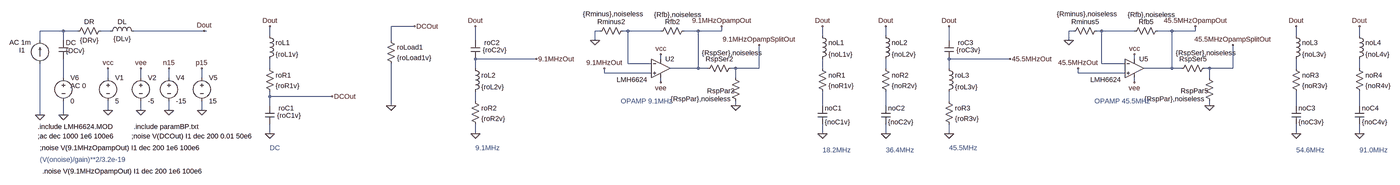
[diagram p0: schematic LT3S4N_9_1MHz.asc, whole sheet]
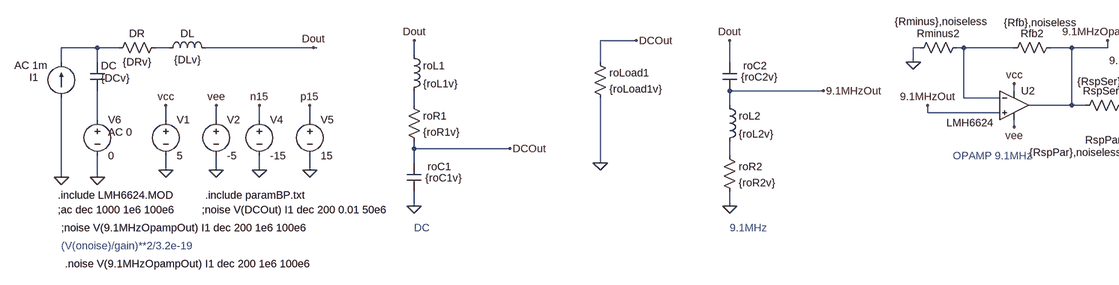
[diagram p1: schematic LT3S4N_9_1MHz.asc, part, row 1 of 1, column 1 of 2]
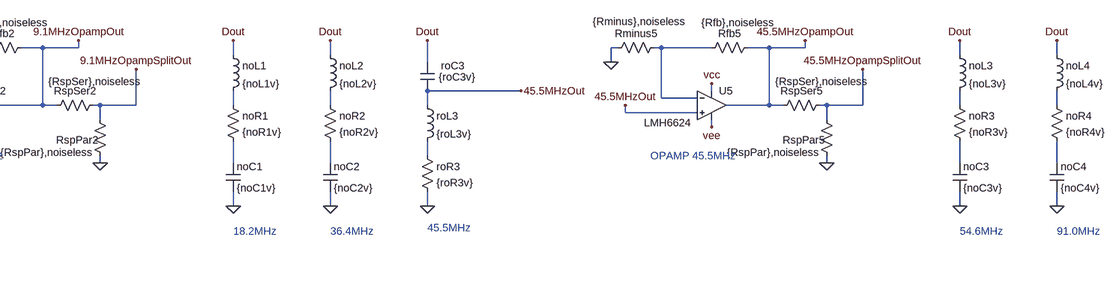
[diagram p2: schematic LT3S4N_9_1MHz.asc, part, row 1 of 1, column 2 of 2]
LT3S4N_9_1MHz.asc, the LTspice schematic file:
Version 4
SHEET 1 3420 1192
WIRE -7720 -3552 -7800 -3552
WIRE -7672 -3552 -7720 -3552
WIRE -7560 -3552 -7592 -3552
WIRE -7240 -3552 -7480 -3552
WIRE -7232 -3552 -7240 -3552
WIRE -7800 -3520 -7800 -3552
WIRE -7720 -3520 -7720 -3552
WIRE -7720 -3392 -7720 -3456
WIRE -7568 -3392 -7568 -3424
WIRE -7456 -3392 -7456 -3424
WIRE -7360 -3392 -7360 -3424
WIRE -7248 -3392 -7248 -3424
WIRE -7568 -3280 -7568 -3312
WIRE -7456 -3280 -7456 -3312
WIRE -7360 -3280 -7360 -3312
WIRE -7248 -3280 -7248 -3312
WIRE -7800 -3264 -7800 -3440
WIRE -7720 -3264 -7720 -3312
FLAG -7568 -3280 0
FLAG -7456 -3280 0
FLAG -7568 -3424 vcc
FLAG -7456 -3424 vee
FLAG -7360 -3280 0
FLAG -7360 -3424 n15
FLAG -7248 -3280 0
FLAG -7248 -3424 p15
FLAG -7800 -3264 0
FLAG -7720 -3264 0
FLAG -7240 -3552 Dout
SYMBOL voltage -7568 -3408 R0
WINDOW 123 0 0 Left 2
WINDOW 39 0 0 Left 2
SYMATTR InstName V1
SYMATTR Value 5
SYMBOL voltage -7456 -3408 R0
WINDOW 123 0 0 Left 2
WINDOW 39 0 0 Left 2
SYMATTR InstName V2
SYMATTR Value -5
SYMBOL voltage -7360 -3408 R0
WINDOW 123 0 0 Left 2
WINDOW 39 0 0 Left 2
SYMATTR InstName V4
SYMATTR Value -15
SYMBOL voltage -7248 -3408 R0
WINDOW 123 0 0 Left 2
WINDOW 39 0 0 Left 2
SYMATTR InstName V5
SYMATTR Value 15
SYMBOL current -7800 -3440 R180
WINDOW 123 31 73 Left 2
WINDOW 39 0 0 Left 2
WINDOW 0 51 46 Left 2
SYMATTR Value2 AC 1m
SYMATTR InstName I1
SYMATTR Value ""
SYMBOL cap -7736 -3520 R0
WINDOW 3 24 36 Left 2
SYMATTR Value {DCv}
SYMATTR InstName DC
SYMBOL res -7576 -3568 R90
WINDOW 0 0 56 VBottom 2
WINDOW 3 32 56 VTop 2
SYMATTR InstName DR
SYMATTR Value {DRv}
SYMBOL voltage -7720 -3408 R0
WINDOW 123 24 44 Left 2
WINDOW 39 0 0 Left 2
SYMATTR Value2 AC 0
SYMATTR InstName V6
SYMATTR Value 0
SYMBOL ind -7576 -3536 R270
WINDOW 0 32 56 VTop 2
WINDOW 3 5 56 VBottom 2
SYMATTR InstName DL
SYMATTR Value {DLv}
TEXT -7808 -3224 Left 2 !.include LMH6624.MOD
TEXT -7480 -3224 Left 2 !.include paramBP.txt
TEXT -7808 -3192 Left 2 !;ac dec 1000 1e6 100e6
TEXT -7488 -3192 Left 2 !;noise V(DCOut) I1 dec 200 0.01 50e6
TEXT -7800 -3152 Left 2 !;noise V(9.1MHzOpampOut) I1 dec 200 1e6 100e6
TEXT -7800 -3112 Left 2 ;(V(onoise)/gain)**2/3.2e-19
TEXT -7792 -3072 Left 2 !.noise V(9.1MHzOpampOut) I1 dec 200 1e6 100e6

WIRE -7016 -3536 -7016 -3568
WIRE -7016 -3424 -7016 -3456
WIRE -7016 -3328 -7016 -3344
WIRE -6760 -3328 -7016 -3328
WIRE -7016 -3296 -7016 -3328
WIRE -7016 -3200 -7016 -3232
FLAG -7016 -3200 0
FLAG -6760 -3328 DCOut
FLAG -7016 -3568 Dout
SYMBOL cap -7032 -3296 R0
WINDOW 0 46 8 Left 2
WINDOW 3 41 33 Left 2
SYMATTR InstName roC1
SYMATTR Value {roC1v}
SYMBOL ind -7032 -3552 R0
SYMATTR InstName roL1
SYMATTR Value {roL1v}
SYMBOL res -7032 -3440 R0
SYMATTR InstName roR1
SYMATTR Value {roR1v}
TEXT -7016 -3152 Left 2 ;DC

WIRE -6464 -3568 -6544 -3568
WIRE -6544 -3520 -6544 -3568
WIRE -6544 -3296 -6544 -3440
FLAG -6544 -3296 0
FLAG -6464 -3568 DCOut
SYMBOL res -6560 -3536 R0
SYMATTR InstName roLoad1
SYMATTR Value {roLoad1v}

WIRE -6248 -3520 -6248 -3568
WIRE -6248 -3456 -6248 -3472
WIRE -6040 -3456 -6248 -3456
WIRE -6248 -3424 -6248 -3456
WIRE -6248 -3312 -6248 -3344
WIRE -6248 -3200 -6248 -3232
FLAG -6248 -3200 0
FLAG -6040 -3456 9.1MHzOut
FLAG -6248 -3568 Dout
SYMBOL cap -6264 -3520 R0
WINDOW 0 46 8 Left 2
WINDOW 3 41 33 Left 2
SYMATTR InstName roC2
SYMATTR Value {roC2v}
SYMBOL ind -6264 -3440 R0
SYMATTR InstName roL2
SYMATTR Value {roL2v}
SYMBOL res -6264 -3328 R0
SYMATTR InstName roR2
SYMATTR Value {roR2v}
TEXT -6248 -3152 Left 2 ;9.1MHz

WIRE -5824 -3552 -5840 -3552
WIRE -5728 -3552 -5744 -3552
WIRE -5616 -3552 -5728 -3552
WIRE -5488 -3552 -5536 -3552
WIRE -5408 -3552 -5408 -3568
WIRE -5408 -3552 -5488 -3552
WIRE -5840 -3520 -5840 -3552
WIRE -5616 -3456 -5616 -3472
WIRE -5728 -3440 -5728 -3552
WIRE -5648 -3440 -5728 -3440
WIRE -5488 -3424 -5488 -3552
WIRE -5488 -3424 -5584 -3424
WIRE -5456 -3424 -5488 -3424
WIRE -5360 -3424 -5376 -3424
WIRE -5280 -3424 -5280 -3504
WIRE -5280 -3424 -5360 -3424
WIRE -5808 -3408 -5808 -3424
WIRE -5648 -3408 -5808 -3408
WIRE -5360 -3392 -5360 -3424
WIRE -5616 -3376 -5616 -3392
WIRE -5360 -3296 -5360 -3312
FLAG -5616 -3376 vee
FLAG -5616 -3472 vcc
FLAG -5840 -3520 0
FLAG -5280 -3504 9.1MHzOpampSplitOut
FLAG -5360 -3296 0
FLAG -5408 -3568 9.1MHzOpampOut
FLAG -5808 -3424 9.1MHzOut
SYMBOL Opamps\\opamp2 -5616 -3488 R0
WINDOW 3 -150 103 Left 2
SYMATTR Value LMH6624
SYMATTR InstName U2
SYMBOL res -5728 -3568 R90
WINDOW 0 0 56 VBottom 2
WINDOW 3 -58 50 VTop 2
SYMATTR InstName Rminus2
SYMATTR Value {Rminus},noiseless
SYMBOL res -5520 -3568 R90
WINDOW 0 0 56 VBottom 2
WINDOW 3 -55 38 VTop 2
SYMATTR InstName Rfb2
SYMATTR Value {Rfb},noiseless
SYMBOL res -5360 -3440 R90
WINDOW 0 0 56 VBottom 2
WINDOW 3 -52 13 VTop 2
SYMATTR InstName RspSer2
SYMATTR Value {RspSer},noiseless
SYMBOL res -5344 -3296 R180
WINDOW 0 20 51 Left 2
WINDOW 3 34 23 Left 2
SYMATTR InstName RspPar2
SYMATTR Value {RspPar},noiseless
TEXT -5752 -3312 Left 2 ;OPAMP 9.1MHz

WIRE -5064 -3536 -5064 -3568
WIRE -5064 -3424 -5064 -3456
WIRE -5064 -3296 -5064 -3344
WIRE -5064 -3200 -5064 -3232
FLAG -5064 -3200 0
FLAG -5064 -3568 Dout
SYMBOL ind -5080 -3552 R0
SYMATTR InstName noL1
SYMATTR Value {noL1v}
SYMBOL cap -5080 -3296 R0
SYMATTR InstName noC1
SYMATTR Value {noC1v}
SYMBOL res -5080 -3440 R0
SYMATTR InstName noR1
SYMATTR Value {noR1v}
TEXT -5064 -3144 Left 2 ;18.2MHz

WIRE -4848 -3536 -4848 -3568
WIRE -4848 -3424 -4848 -3456
WIRE -4848 -3296 -4848 -3344
WIRE -4848 -3200 -4848 -3232
FLAG -4848 -3200 0
FLAG -4848 -3568 Dout
SYMBOL ind -4864 -3552 R0
SYMATTR InstName noL2
SYMATTR Value {noL2v}
SYMBOL cap -4864 -3296 R0
SYMATTR InstName noC2
SYMATTR Value {noC2v}
SYMBOL res -4864 -3440 R0
SYMATTR InstName noR2
SYMATTR Value {noR2v}
TEXT -4848 -3144 Left 2 ;36.4MHz

WIRE -4632 -3520 -4632 -3568
WIRE -4632 -3456 -4632 -3472
WIRE -4424 -3456 -4632 -3456
WIRE -4632 -3424 -4632 -3456
WIRE -4632 -3312 -4632 -3344
WIRE -4632 -3200 -4632 -3232
FLAG -4632 -3200 0
FLAG -4424 -3456 45.5MHzOut
FLAG -4632 -3568 Dout
SYMBOL cap -4648 -3520 R0
WINDOW 0 46 8 Left 2
WINDOW 3 41 33 Left 2
SYMATTR InstName roC3
SYMATTR Value {roC3v}
SYMBOL ind -4648 -3440 R0
SYMATTR InstName roL3
SYMATTR Value {roL3v}
SYMBOL res -4648 -3328 R0
SYMATTR InstName roR3
SYMATTR Value {roR3v}
TEXT -4632 -3152 Left 2 ;45.5MHz

WIRE -4208 -3552 -4224 -3552
WIRE -4112 -3552 -4128 -3552
WIRE -4000 -3552 -4112 -3552
WIRE -3872 -3552 -3920 -3552
WIRE -3792 -3552 -3792 -3568
WIRE -3792 -3552 -3872 -3552
WIRE -4224 -3520 -4224 -3552
WIRE -4000 -3456 -4000 -3472
WIRE -4112 -3440 -4112 -3552
WIRE -4032 -3440 -4112 -3440
WIRE -3872 -3424 -3872 -3552
WIRE -3872 -3424 -3968 -3424
WIRE -3840 -3424 -3872 -3424
WIRE -3744 -3424 -3760 -3424
WIRE -3664 -3424 -3664 -3504
WIRE -3664 -3424 -3744 -3424
WIRE -4192 -3408 -4192 -3424
WIRE -4032 -3408 -4192 -3408
WIRE -3744 -3392 -3744 -3424
WIRE -4000 -3376 -4000 -3392
WIRE -3744 -3296 -3744 -3312
FLAG -4000 -3376 vee
FLAG -4000 -3472 vcc
FLAG -4224 -3520 0
FLAG -3664 -3504 45.5MHzOpampSplitOut
FLAG -3744 -3296 0
FLAG -3792 -3568 45.5MHzOpampOut
FLAG -4192 -3424 45.5MHzOut
SYMBOL Opamps\\opamp2 -4000 -3488 R0
WINDOW 3 -150 103 Left 2
SYMATTR Value LMH6624
SYMATTR InstName U5
SYMBOL res -4112 -3568 R90
WINDOW 0 0 56 VBottom 2
WINDOW 3 -58 50 VTop 2
SYMATTR InstName Rminus5
SYMATTR Value {Rminus},noiseless
SYMBOL res -3904 -3568 R90
WINDOW 0 0 56 VBottom 2
WINDOW 3 -55 38 VTop 2
SYMATTR InstName Rfb5
SYMATTR Value {Rfb},noiseless
SYMBOL res -3744 -3440 R90
WINDOW 0 0 56 VBottom 2
WINDOW 3 -52 13 VTop 2
SYMATTR InstName RspSer5
SYMATTR Value {RspSer},noiseless
SYMBOL res -3728 -3296 R180
WINDOW 0 20 51 Left 2
WINDOW 3 34 23 Left 2
SYMATTR InstName RspPar5
SYMATTR Value {RspPar},noiseless
TEXT -4136 -3312 Left 2 ;OPAMP 45.5MHz

WIRE -3448 -3536 -3448 -3568
WIRE -3448 -3424 -3448 -3456
WIRE -3448 -3296 -3448 -3344
WIRE -3448 -3200 -3448 -3232
FLAG -3448 -3200 0
FLAG -3448 -3568 Dout
SYMBOL ind -3464 -3552 R0
SYMATTR InstName noL3
SYMATTR Value {noL3v}
SYMBOL cap -3464 -3296 R0
SYMATTR InstName noC3
SYMATTR Value {noC3v}
SYMBOL res -3464 -3440 R0
SYMATTR InstName noR3
SYMATTR Value {noR3v}
TEXT -3448 -3144 Left 2 ;54.6MHz

WIRE -3232 -3536 -3232 -3568
WIRE -3232 -3424 -3232 -3456
WIRE -3232 -3296 -3232 -3344
WIRE -3232 -3200 -3232 -3232
FLAG -3232 -3200 0
FLAG -3232 -3568 Dout
SYMBOL ind -3248 -3552 R0
SYMATTR InstName noL4
SYMATTR Value {noL4v}
SYMBOL cap -3248 -3296 R0
SYMATTR InstName noC4
SYMATTR Value {noC4v}
SYMBOL res -3248 -3440 R0
SYMATTR InstName noR4
SYMATTR Value {noR4v}
TEXT -3232 -3144 Left 2 ;91.0MHz

The netlist it stands for:
* LT3S4N_9_1MHz.asc
V1 vcc 0 5
V2 vee 0 -5
V4 n15 0 -15
V5 p15 0 15
I1 0 N001 AC 1m
C§DC N001 N003 {DCv}
R§DR N002 N001 {DRv}
V6 N003 0 0 AC 0
L§DL N002 Dout {DLv}
C§roC1 DCOut 0 {roC1v}
L§roL1 Dout N004 {roL1v}
roR1 N004 DCOut {roR1v}
roLoad1 DCOut 0 {roLoad1v}
C§roC2 Dout 9.1MHzOut {roC2v}
L§roL2 9.1MHzOut N005 {roL2v}
roR2 N005 0 {roR2v}
XU2 9.1MHzOut N006 vcc vee 9.1MHzOpampOut LMH6624  ; pins In+ In- V+ V- OUT
Rminus2 N006 0 {Rminus},noiseless
Rfb2 9.1MHzOpampOut N006 {Rfb},noiseless
RspSer2 9.1MHzOpampSplitOut 9.1MHzOpampOut {RspSer},noiseless
RspPar2 0 9.1MHzOpampSplitOut {RspPar},noiseless
L§noL1 Dout N007 {noL1v}
C§noC1 N008 0 {noC1v}
R§noR1 N007 N008 {noR1v}
L§noL2 Dout N009 {noL2v}
C§noC2 N010 0 {noC2v}
R§noR2 N009 N010 {noR2v}
C§roC3 Dout 45.5MHzOut {roC3v}
L§roL3 45.5MHzOut N011 {roL3v}
roR3 N011 0 {roR3v}
XU5 45.5MHzOut N012 vcc vee 45.5MHzOpampOut LMH6624  ; pins In+ In- V+ V- OUT
Rminus5 N012 0 {Rminus},noiseless
Rfb5 45.5MHzOpampOut N012 {Rfb},noiseless
RspSer5 45.5MHzOpampSplitOut 45.5MHzOpampOut {RspSer},noiseless
RspPar5 0 45.5MHzOpampSplitOut {RspPar},noiseless
L§noL3 Dout N013 {noL3v}
C§noC3 N014 0 {noC3v}
R§noR3 N013 N014 {noR3v}
L§noL4 Dout N015 {noL4v}
C§noC4 N016 0 {noC4v}
R§noR4 N015 N016 {noR4v}
.include LMH6624.MOD
.include paramBP.txt
;ac dec 1000 1e6 100e6
;noise V(DCOut) I1 dec 200 0.01 50e6
;noise V(9.1MHzOpampOut) I1 dec 200 1e6 100e6
* (V(onoise)/gain)**2/3.2e-19
.noise V(9.1MHzOpampOut) I1 dec 200 1e6 100e6
* DC
* 9.1MHz
* OPAMP 9.1MHz
* 18.2MHz
* 36.4MHz
* 45.5MHz
* OPAMP 45.5MHz
* 54.6MHz
* 91.0MHz
.backanno
.end